# Altium schematic sheet DCBLOCKx4DIFFd.SchDoc
size A3
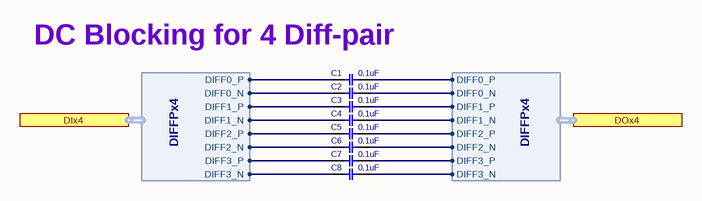
[diagram p0: DCBLOCKx4DIFFd.SchDoc]

## Parts
C1  0.1uF  [C0402]
C2  0.1uF  [C0402]
C3  0.1uF  [C0402]
C4  0.1uF  [C0402]
C5  0.1uF  [C0402]
C6  0.1uF  [C0402]
C7  0.1uF  [C0402]
C8  0.1uF  [C0402]

## Ports
DIx4 (harness DIFFPx4), DOx4 (harness DIFFPx4)

## Harnesses
DIFFPx4: DIFF0_P, DIFF1_N, DIFF1_P, DIFF2_N, DIFF2_P, DIFF3_N, DIFF3_P, DIFF0_N

## Nets
NetC1_1: C1.1 ; port DIx4.DIFF0_P
NetC1_2: C1.2 ; port DOx4.DIFF0_P
NetC2_1: C2.1 ; port DIx4.DIFF0_N
NetC2_2: C2.2 ; port DOx4.DIFF0_N
NetC3_1: C3.1 ; port DIx4.DIFF1_P
NetC3_2: C3.2 ; port DOx4.DIFF1_P
NetC4_1: C4.1 ; port DIx4.DIFF1_N
NetC4_2: C4.2 ; port DOx4.DIFF1_N
NetC5_1: C5.1 ; port DIx4.DIFF2_P
NetC5_2: C5.2 ; port DOx4.DIFF2_P
NetC6_1: C6.1 ; port DIx4.DIFF2_N
NetC6_2: C6.2 ; port DOx4.DIFF2_N
NetC7_1: C7.1 ; port DIx4.DIFF3_P
NetC7_2: C7.2 ; port DOx4.DIFF3_P
NetC8_1: C8.1 ; port DIx4.DIFF3_N
NetC8_2: C8.2 ; port DOx4.DIFF3_N

## Notes on the sheet
- DC Blocking for 4 Diff-pair
- Title
- Size:
- Date:
- A3
- Number:
- Time:
- Revision:
- Sheet
- of
- File:

## Library data of the parts
C1-C8 = CAP_SMD_MLCC_100n50TDK: CAP, MLCC, 100nF, 50V, X7R, 10%, 0402C; PARAM: X7R, 10%, -55~125oC; MANF_P#: GCM155R71H104KE02D; MANF: Murata; PARAM2: 50V; ASSEMBLY: ASSEMBLY; PRICE: 100= 4$; VALUE: 0.1uF